# EAGLE schematic xmas (EAGLE 6.0)
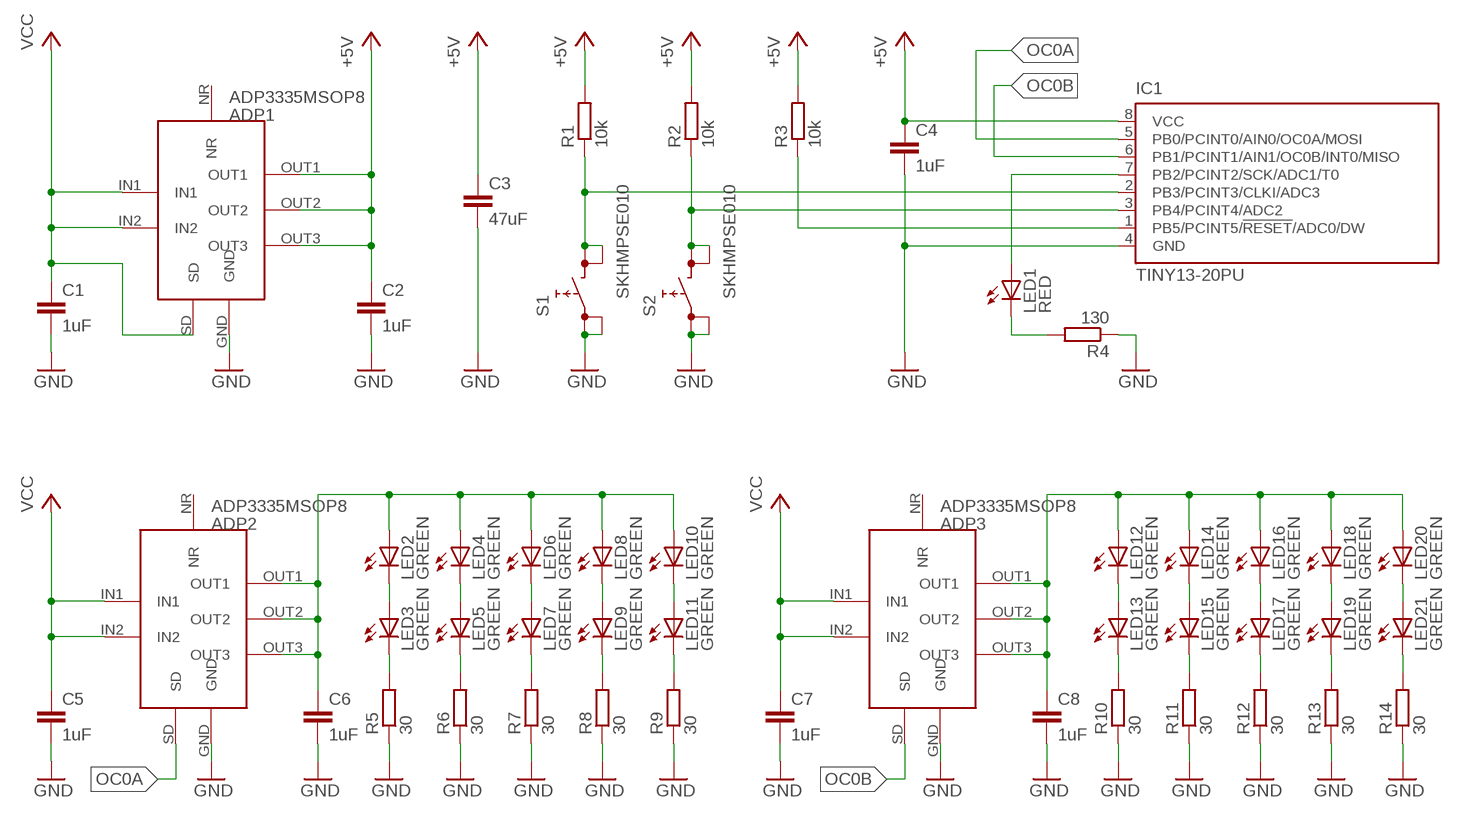
[diagram p0: schematic, sheet 1]

## Parts
ADP1  ADP3335MSOP8  [MSOP8]
ADP2  ADP3335MSOP8  [MSOP8]
ADP3  ADP3335MSOP8  [MSOP8]
C1  1uF  C-EUC1206  [C1206]
C2  1uF  C-EUC1206  [C1206]
C3  47uF  C-EU075-032X103  [C075-032X103]
C4  1uF  C-EUC1206  [C1206]
C5  1uF  C-EUC1206  [C1206]
C6  1uF  C-EUC1206  [C1206]
C7  1uF  C-EUC1206  [C1206]
C8  1uF  C-EUC1206  [C1206]
IC1  TINY13-20PU  [DIL08]
LED1  RED  LED  [SMARTLED-TTW]
LED2  GREEN  LED  [SMARTLED-TTW]
LED3  GREEN  LED  [SMARTLED-TTW]
LED4  GREEN  LED  [SMARTLED-TTW]
LED5  GREEN  LED  [SMARTLED-TTW]
LED6  GREEN  LED  [SMARTLED-TTW]
LED7  GREEN  LED  [SMARTLED-TTW]
LED8  GREEN  LED  [SMARTLED-TTW]
LED9  GREEN  LED  [SMARTLED-TTW]
LED10  GREEN  LED  [SMARTLED-TTW]
LED11  GREEN  LED  [SMARTLED-TTW]
LED12  GREEN  LED  [SMARTLED-TTW]
LED13  GREEN  LED  [SMARTLED-TTW]
LED14  GREEN  LED  [SMARTLED-TTW]
LED15  GREEN  LED  [SMARTLED-TTW]
LED16  GREEN  LED  [SMARTLED-TTW]
LED17  GREEN  LED  [SMARTLED-TTW]
LED18  GREEN  LED  [SMARTLED-TTW]
LED19  GREEN  LED  [SMARTLED-TTW]
LED20  GREEN  LED  [SMARTLED-TTW]
LED21  GREEN  LED  [SMARTLED-TTW]
R1  10k  R-EU_R1206  [R1206]
R2  10k  R-EU_R1206  [R1206]
R3  10k  R-EU_R1206  [R1206]
R4  130  R-EU_0207/10  [0207/10]
R5  30  R-EU_R1206  [R1206]
R6  30  R-EU_R1206  [R1206]
R7  30  R-EU_R1206  [R1206]
R8  30  R-EU_R1206  [R1206]
R9  30  R-EU_R1206  [R1206]
R10  30  R-EU_R1206  [R1206]
R11  30  R-EU_R1206  [R1206]
R12  30  R-EU_R1206  [R1206]
R13  30  R-EU_R1206  [R1206]
R14  30  R-EU_R1206  [R1206]
S1  SKHMPSE010  [SKHMPXE010]
S2  SKHMPSE010  [SKHMPXE010]

## Nets
+5V: ADP1.OUT1 ADP1.OUT2 ADP1.OUT3 C2.1 C3.1 C4.1 IC1.8(VCC) R1.2 R2.2 R3.2
GND: ADP1.GND ADP2.GND ADP3.GND C1.2 C2.2 C3.2 C4.2 C5.2 C6.2 C7.2 C8.2 IC1.4(GND) R4.1 R5.1 R6.1 R7.1 R8.1 R9.1 R10.1 R11.1 R12.1 R13.1 R14.1 S1.1(1.1) S1.2(1.2) S2.1(1.1) S2.2(1.2)
N$1: IC1.2(PB3/PCINT3/CLKI/ADC3) R1.1 S1.3(2.1) S1.4(2.2)
N$2: IC1.3(PB4/PCINT4/ADC2) R2.1 S2.3(2.1) S2.4(2.2)
N$3: IC1.1(PB5/PCINT5/!RESET!/ADC0/DW) R3.1
N$4: LED1.C@1(C) R4.2
N$5: ADP2.OUT1 ADP2.OUT2 ADP2.OUT3 C6.1 LED2.A@1(A) LED4.A@1(A) LED6.A@1(A) LED8.A@1(A) LED10.A@1(A)
N$6: IC1.7(PB2/PCINT2/SCK/ADC1/T0) LED1.A@1(A)
N$7: LED2.C@1(C) LED3.A@1(A)
N$8: LED3.C@1(C) R5.2
N$9: ADP3.OUT1 ADP3.OUT2 ADP3.OUT3 C8.1 LED12.A@1(A) LED14.A@1(A) LED16.A@1(A) LED18.A@1(A) LED20.A@1(A)
N$10: LED4.C@1(C) LED5.A@1(A)
N$11: LED5.C@1(C) R6.2
N$12: LED12.C@1(C) LED13.A@1(A)
N$13: LED6.C@1(C) LED7.A@1(A)
N$14: LED7.C@1(C) R7.2
N$15: LED13.C@1(C) R10.2
N$16: LED8.C@1(C) LED9.A@1(A)
N$17: LED9.C@1(C) R8.2
N$18: LED14.C@1(C) LED15.A@1(A)
N$19: LED10.C@1(C) LED11.A@1(A)
N$20: LED11.C@1(C) R9.2
N$21: LED15.C@1(C) R11.2
N$22: LED16.C@1(C) LED17.A@1(A)
N$23: LED17.C@1(C) R12.2
N$24: LED18.C@1(C) LED19.A@1(A)
N$25: LED19.C@1(C) R13.2
N$26: LED20.C@1(C) LED21.A@1(A)
N$27: LED21.C@1(C) R14.2
OC0A: ADP2.SD IC1.5(PB0/PCINT0/AIN0/OC0A/MOSI)
OC0B: ADP3.SD IC1.6(PB1/PCINT1/AIN1/OC0B/INT0/MISO)
VCC: ADP1.IN1 ADP1.IN2 ADP1.SD ADP2.IN1 ADP2.IN2 ADP3.IN1 ADP3.IN2 C1.1 C5.1 C7.1
Unconnected: ADP1.NR ADP2.NR ADP3.NR

## Library data of the parts
ADP1-ADP3 = Gumix:ADP3335
C1-C8 = rcl:C-EU: CAPACITOR, European symbol
IC1 = atmel:TINY13: 8-bit AVR Microcontroller with 1K Bytes In-System Programmable Flash Source: http://www.atmel.com/dyn/resources/prod_documents/2535S.pdf; MPN: ATTINY13-20PU; OC_FARNELL: 9171550; OC_NEWARK: 96K6521
LED1-LED21 = led:LED: LED OSRAM: - CHIPLED LG R971, LG N971, LY N971, LG Q971, LY Q971, LO R971, LY R971 LH N974, LH R974 LS Q976, LO Q976, LY Q976 LO Q996 - Hyper CHIPLED LW Q18S LB Q993, LB Q99A, LB R99A - SideLED LS A670, LO A670, LY A670, LG A670, LP A670 LB A673, LV A673, LT A673, LW A673 LH A674 LY A675 LS A676, LA A676, LO A676, LY A676, LW A676 LS A679, LY A679, LG A679 - Hyper Micro SIDELED® LS Y876, LA Y876, LO Y876, LY Y876 LT Y87S - SmartLED LW L88C, LW L88S LB L89C, LB L89S, LG L890 LS L89K, LO L89K, LY L89K LS L896, LA L896, LO L896, LY L896 - TOPLED LS T670, LO T670, LY T670, LG T670, LP T670 LSG T670, LSP T670, LSY T670, LOP T670, LYG T670 LG T671, LOG T671, LSG T671 LB T673, LV T673, LT T673, LW T673 LH T674 LS T676, LA T676, LO T676, LY T676, LB T676, LH T676, LSB T676, LW T676 LB T67C, LV T67C, LT T67C, LS T67K, LO T67K, LY T67K, LW E67C LS E67B, LA E67B, LO E67B, LY E67B, LB E67C, LV E67C, LT E67C LW T67C LS T679, LY T679, LG T679 LS T770, LO T770, LY T770, LG T770, LP T770 LB T773, LV T773, LT T773, LW T773 LH T774 LS E675, LA E675, LY E675, LS T675 LS T776, LA T776, LO T776, LY T776, LB T776 LHGB T686 LT T68C, LB T68C - Hyper Mini TOPLED® LB M676 - Mini TOPLED Santana® LG M470 LS M47K, LO M47K, LY M47K Source: http://www.osram.convergy.de LUXEON: - LUMILED® LXK2-PW12-R00, LXK2-PW12-S00, LXK2-PW14-U00, LXK2-PW14-V00 LXK2-PM12-R00, LXK2-PM12-S00, LXK2-PM14-U00 LXK2-PE12-Q00, LXK2-PE12-R00, LXK2-PE12-S00, LXK2-PE14-T00, LXK2-PE14-U00 LXK2-PB12-K00, LXK2-PB12-L00, LXK2-PB12-M00, LXK2-PB14-N00, LXK2-PB14-P00, LXK2-PB14-Q00 LXK2-PR12-L00, LXK2-PR12-M00, LXK2-PR14-Q00, LXK2-PR14-R00 LXK2-PD12-Q00, LXK2-PD12-R00, LXK2-PD12-S00 LXK2-PH12-R00, LXK2-PH12-S00 LXK2-PL12-P00, LXK2-PL12-Q00, LXK2-PL12-R00 Source: www.luxeon.com KINGBRIGHT: KA-3528ASYC Source: www.kingbright.com
R1-R14 = rcl:R-EU_: RESISTOR, European symbol
S1 S2 = Gumix:SKHMP*E010: 6.2 X 6.5mm TACT Switch (SMD) Source: http://www3.alps.co.jp/WebObjects/catalog.woa/PDF/E/Switch/Tact/SKHM/SKHM.PDF